# EAGLE design butter-test (EAGLE 6.5.0)
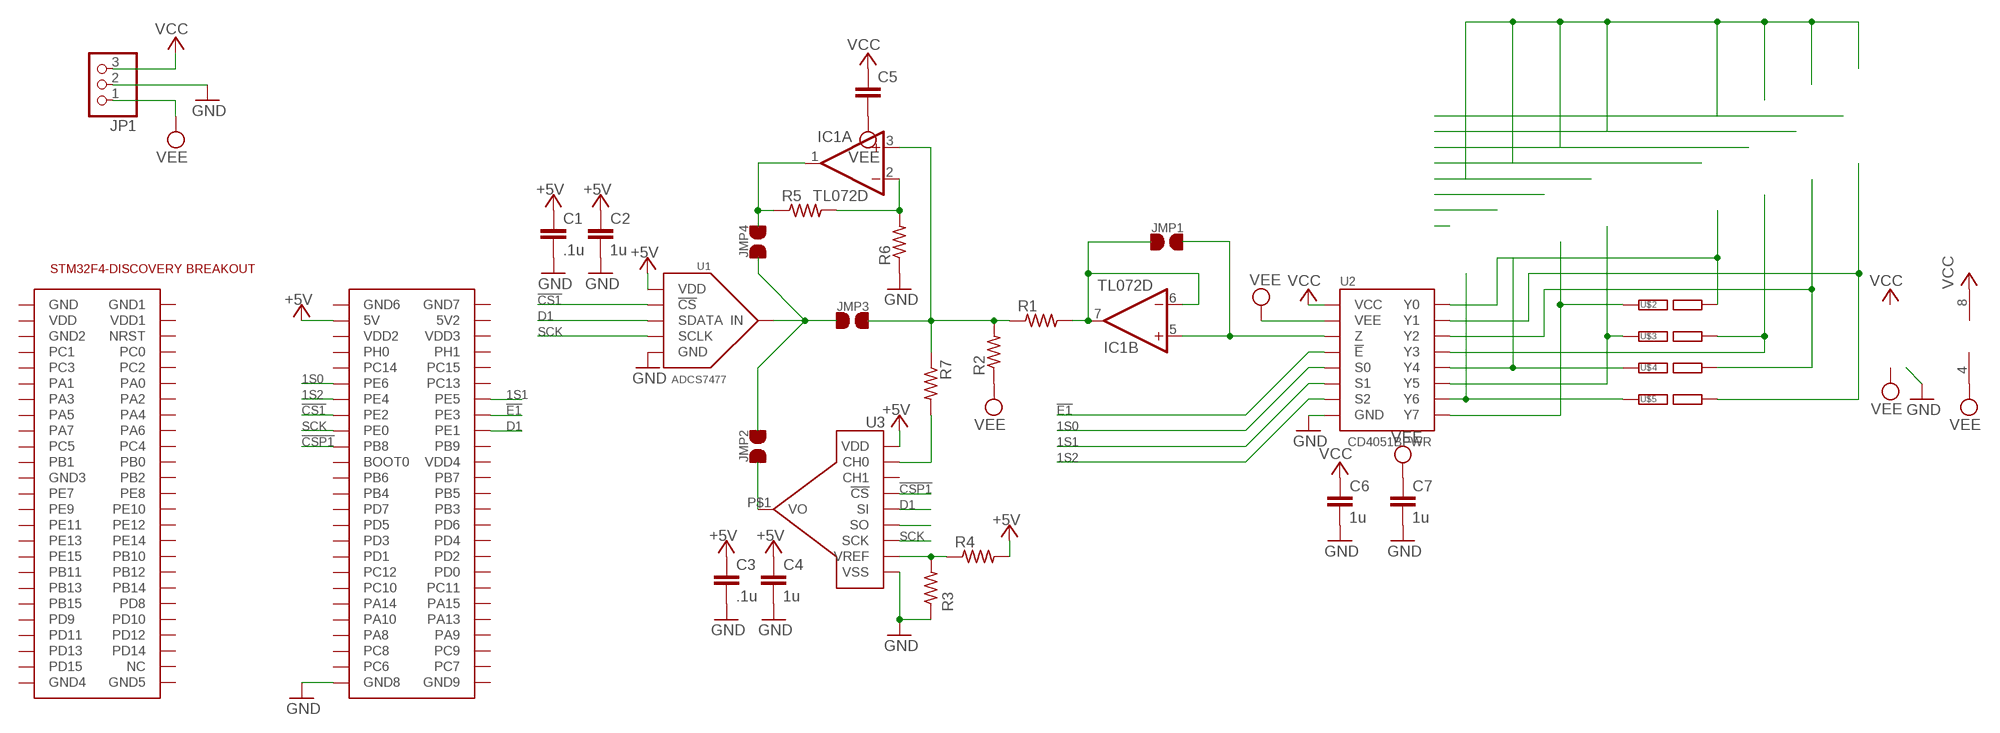
[diagram p0: schematic, sheet 1]

## Parts
C1  .1u  C-EUC0805  [C0805]
C2  1u  C-EUC0805  [C0805]
C3  .1u  C-EUC0805  [C0805]
C4  1u  C-EUC0805  [C0805]
C5  C-EUC0805  [C0805]
C6  1u  C-EUC0805  [C0805]
C7  1u  C-EUC0805  [C0805]
IC1  TL072D  [SO08]
JMP1  JMP  [JMP]
JMP2  JMP  [JMP]
JMP3  JMP  [JMP]
JMP4  JMP  [JMP]
JP1  PINHD-1X3  [1X03]
R1  R-US_R0603  [R0603]
R2  R-US_R0603  [R0603]
R3  R-US_R0603  [R0603]
R4  R-US_R0603  [R0603]
R5  R-US_R0603  [R0603]
R6  R-US_R0603  [R0603]
R7  R-US_R0603  [R0603]
U1  ADCS7477  [SOT-23-6]
U2  CD4051BPWR  [TSSOP-16]
U3  MCP6S93  [MSOP-10]
U$1  STM32F4-DISCOVERY  [STM32F4-DISCOVERY]
U$2  RAILSEP  [RAIL]
U$3  RAILSEP  [RAIL]
U$4  RAILSEP  [RAIL]
U$5  RAILSEP  [RAIL]

## Nets
1S0: U2.P$11(S0) U$1.P$61(PE6)
1S1: U2.P$10(S1) U$1.P$64(PE5)
1S2: U2.P$9(S2) U$1.P$63(PE4)
!CS1: U1.P$6(!CS) U$1.P$65(PE2)
!CSP1: U3.P$6(!CS) U$1.P$69(PB8)
!E1: U2.P$6(!E) U$1.P$66(PE3)
+5V: C1.1 C2.1 C3.1 C4.1 R4.2 U1.P$1(VDD) U3.P$10(VDD) U$1.P$53(5V)
D1: U1.P$5(SDATA) U3.P$7(SI) U$1.P$68(PE1)
GND: C1.2 C2.2 C3.2 C4.2 C6.2 C7.2 JP1.2 R3.1 R6.1 U1.P$2(GND) U2.P$8(GND) U3.P$5(VSS) U$1.P$99(GND8)
N$1: IC1.2(A:-IN) R5.2 R6.2
N$2: U2.P$13(Y0) U$2.P$R(R)
N$3: U2.P$5(Y5) U$3.P$L(L)
N$4: IC1.5(B:+IN) JMP1.P$2 U2.P$3(Z)
N$5: JMP2.P$1 U3.P$1(VO)
N$6: IC1.6(B:-IN) IC1.7(B:OUT) JMP1.P$1 R1.2
N$7: U2.P$4(Y7) U$2.P$L(L)
N$8: U2.P$12(Y3) U$3.P$R(R)
N$9: U2.P$1(Y4) U$4.P$L(L)
N$10: U2.P$15(Y2) U$4.P$R(R)
N$11: U2.P$2(Y6) U$5.P$L(L)
N$12: U2.P$14(Y1) U$5.P$R(R)
N$22: IC1.3(A:+IN) JMP3.P$2 R1.1 R2.2 R7.1
N$23: R3.2 R4.1 U3.P$4(VREF)
N$24: JMP2.P$2 JMP3.P$1 JMP4.P$1 U1.P$3(IN)
N$25: U3.P$8(SO)
N$26: IC1.1(A:OUT) JMP4.P$2 R5.1
N$27: R7.2 U3.P$2(CH0)
SCK: U1.P$4(SCLK) U3.P$9(SCK) U$1.P$67(PE0)
VCC: C5.1 C6.1 IC1.8(P:V+) JP1.3 U2.P$16(VCC)
VEE: C5.2 C7.1 IC1.4(P:V-) JP1.1 R2.1 U2.P$7(VEE)
Unconnected: U3.P$3(CH1) U$1.P$1(GND) U$1.P$2(GND1) U$1.P$3(VDD) U$1.P$4(VDD1) U$1.P$5(GND2) U$1.P$6(NRST) U$1.P$7(PC1) U$1.P$8(PC0) U$1.P$9(PC3) U$1.P$10(PC2) U$1.P$11(PA1) U$1.P$12(PA0) U$1.P$13(PA3) U$1.P$14(PA2) U$1.P$15(PA5) U$1.P$16(PA4) U$1.P$17(PA7) U$1.P$18(PA6) U$1.P$19(PC5) U$1.P$20(PC4) U$1.P$21(PB1) U$1.P$22(PB0) U$1.P$23(GND3) U$1.P$24(PB2) U$1.P$25(PE7) U$1.P$26(PE8) U$1.P$27(PE9) U$1.P$28(PE10) U$1.P$29(PE11) U$1.P$30(PE12) U$1.P$31(PE13) U$1.P$32(PE14) U$1.P$33(PE15) U$1.P$34(PB10) U$1.P$35(PB11) U$1.P$36(PB12) U$1.P$37(PB13) U$1.P$38(PB14) U$1.P$39(PB15) U$1.P$40(PD8) U$1.P$41(PD9) U$1.P$42(PD10) U$1.P$43(PD11) U$1.P$44(PD12) U$1.P$45(PD13) U$1.P$46(PD14) U$1.P$47(PD15) U$1.P$48(NC) U$1.P$49(GND4) U$1.P$50(GND5) U$1.P$51(GND6) U$1.P$52(GND7) U$1.P$54(5V2) U$1.P$55(VDD2) U$1.P$56(VDD3) U$1.P$57(PH0) U$1.P$58(PH1) U$1.P$59(PC14) U$1.P$60(PC15) U$1.P$62(PC13) U$1.P$70(PB9) U$1.P$71(BOOT0) U$1.P$72(VDD4) U$1.P$73(PB6) U$1.P$74(PB7) U$1.P$75(PB4) U$1.P$76(PB5) U$1.P$77(PD7) U$1.P$78(PB3) U$1.P$79(PD5) U$1.P$80(PD6) U$1.P$81(PD3) U$1.P$82(PD4) U$1.P$83(PD1) U$1.P$84(PD2) U$1.P$85(PC12) U$1.P$86(PD0) U$1.P$87(PC10) U$1.P$88(PC11) U$1.P$89(PA14) U$1.P$90(PA15) U$1.P$91(PA10) U$1.P$92(PA13) U$1.P$93(PA8) U$1.P$94(PA9) U$1.P$95(PC8) U$1.P$96(PC9) U$1.P$97(PC6) U$1.P$98(PC7) U$1.P$100(GND9)

## Library data of the parts
C1-C7 = rcl:C-EU: CAPACITOR, European symbol
IC1 = linear:TL072: OP AMP
JMP1-JMP4 = butter:JMP
JP1 = pinhead:PINHD-1X3: PIN HEADER
R1-R7 = resistor:R-US_: RESISTOR, American symbol
U1 = butter:ADCS7477: TI ADCS7477 10 bit 1MSPS ADC 5V 10mW Digikey <http://www.digikey.com/product-detail/en/ADCS7477AIMF%2FNOPB/ADCS7477AIMF%2FNOPBTR-ND/568478>
U2 = butter:CD4051BPWR: CD4051BPWR TI 8:1 Analog Multiplexer Digikey <http://www.digikey.com/product-detail/en/CD4051BPWR/296-11993-1-ND/390442>
U3 = butter:MCP6S93
U$1 = STM32F4-DISCOVERY:STM32F4-DISCOVERY
U$2-U$5 = butter:RAILSEP

## Board
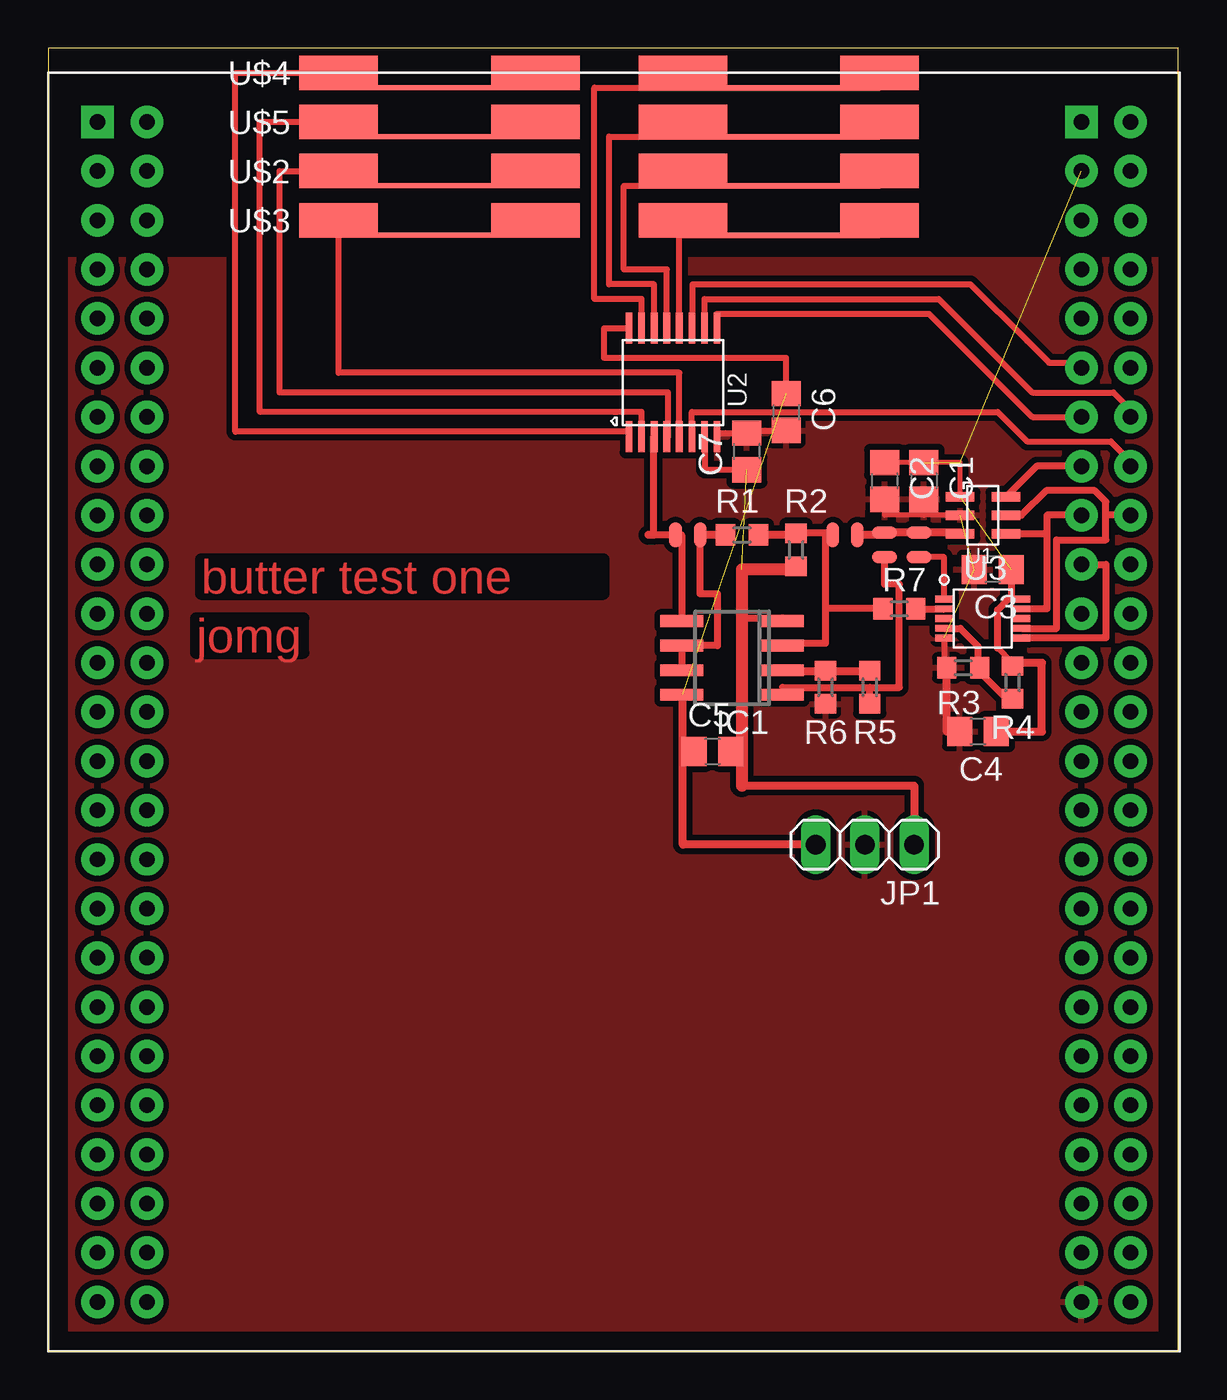
[diagram p1: board, top side]

Size 58.34 x 67.3 mm. Coordinates in mm from the lower left corner, seen from the top.
Outline: 0,0 58.34,0 58.34,67.3 0,67.3 0,0
Copper layers (1*16): Top 0.035mm / dielectric 1.5mm / Bottom 0.035mm
Design rules "default *": minimum track width 10mil, minimum drill 24mil, track to track 10mil, track to pad 10mil, pad to pad 8mil, via to via 8mil, smd to smd 8mil, copper to edge 40mil, drill to drill 8mil, minimum pad ring 10mil, minimum via ring 8mil, stop-mask expansion 4mil, vias tented up to drill 0mil, thermal gap 10mil

### Footprints (pad centres in the part's own frame; a part is rotated, then mirrored left to right if it is on the bottom)
C0805 = smd 1.3 x 1.5: 1 -0.95,0; 2 0.95,0
SO08 = smd 0.6 x 2.2: 1 -1.905,-2.6; 2 -0.635,-2.6; 3 0.635,-2.6; 4 1.905,-2.6; 5 1.905,2.6; 6 0.635,2.6; 7 -0.635,2.6; 8 -1.905,2.6
JMP = smd 0.635 x 1.27: P$1 -0.635,0; P$2 0.635,0
1X03 = drill 1.016 long: 1 -2.54,0; 2 0,0; 3 2.54,0
R0603 = smd 1 x 1.1: 1 -0.85,0; 2 0.85,0
SOT-23-6 = smd 1.473 x 0.483: P$1 -1.181,0.95; P$2 -1.181,0; P$3 -1.181,-0.95; P$4 1.181,-0.95; P$5 1.181,0; P$6 1.181,0.95
TSSOP-16 = smd 1.6 x 0.35: P$1 -2.8,2.275; P$2 -2.8,1.625; P$3 -2.8,0.975; P$4 -2.8,0.325; P$5 -2.8,-0.325; P$6 -2.8,-0.975; P$7 -2.8,-1.625; P$8 -2.8,-2.275; P$9 2.8,-2.275; P$10 2.8,-1.625; P$11 2.8,-0.975; P$12 2.8,-0.325; P$13 2.8,0.325; P$14 2.8,0.975; P$15 2.8,1.625; P$16 2.8,2.275
MSOP-10 = smd 0.9 x 0.35: P$1 -2,1; P$2 -2,0.5; P$3 -2,0; P$4 -2,-0.5; P$5 -2,-1; P$6 2,-1; P$7 2,-0.5; P$8 2,0; P$9 2,0.5; P$10 2,1
STM32F4-DISCOVERY = drill 0.8 pad 1.676 square: P$1 -27.94,30.48; P$51 22.86,30.48 | drill 0.8 pad 1.676: P$2 -25.4,30.48; P$3 -27.94,27.94; P$4 -25.4,27.94; P$5 -27.94,25.4; P$6 -25.4,25.4; P$7 -27.94,22.86; P$8 -25.4,22.86; P$9 -27.94,20.32; P$10 -25.4,20.32; P$11 -27.94,17.78; P$12 -25.4,17.78; P$13 -27.94,15.24; P$14 -25.4,15.24; P$15 -27.94,12.7; P$16 -25.4,12.7; P$17 -27.94,10.16; P$18 -25.4,10.16; P$19 -27.94,7.62; P$20 -25.4,7.62; P$21 -27.94,5.08; P$22 -25.4,5.08; P$23 -27.94,2.54; P$24 -25.4,2.54; P$25 -27.94,0; P$26 -25.4,0; P$27 -27.94,-2.54; P$28 -25.4,-2.54; P$29 -27.94,-5.08; P$30 -25.4,-5.08; P$31 -27.94,-7.62; P$32 -25.4,-7.62; P$33 -27.94,-10.16; P$34 -25.4,-10.16; P$35 -27.94,-12.7; P$36 -25.4,-12.7; P$37 -27.94,-15.24; P$38 -25.4,-15.24; P$39 -27.94,-17.78; P$40 -25.4,-17.78; P$41 -27.94,-20.32; P$42 -25.4,-20.32; P$43 -27.94,-22.86; P$44 -25.4,-22.86; P$45 -27.94,-25.4; P$46 -25.4,-25.4; P$47 -27.94,-27.94; P$48 -25.4,-27.94; P$49 -27.94,-30.48; P$50 -25.4,-30.48; P$52 25.4,30.48; P$53 22.86,27.94; P$54 25.4,27.94; P$55 22.86,25.4; P$56 25.4,25.4; P$57 22.86,22.86; P$58 25.4,22.86; P$59 22.86,20.32; P$60 25.4,20.32; P$61 22.86,17.78; P$62 25.4,17.78; P$63 22.86,15.24; P$64 25.4,15.24; P$65 22.86,12.7; P$66 25.4,12.7; P$67 22.86,10.16; P$68 25.4,10.16; P$69 22.86,7.62; P$70 25.4,7.62; P$71 22.86,5.08; P$72 25.4,5.08; P$73 22.86,2.54; P$74 25.4,2.54; P$75 22.86,0; P$76 25.4,0; P$77 22.86,-2.54; P$78 25.4,-2.54; P$79 22.86,-5.08; P$80 25.4,-5.08; P$81 22.86,-7.62; P$82 25.4,-7.62; P$83 22.86,-10.16; P$84 25.4,-10.16; P$85 22.86,-12.7; P$86 25.4,-12.7; P$87 22.86,-15.24; P$88 25.4,-15.24; P$89 22.86,-17.78; P$90 25.4,-17.78; P$91 22.86,-20.32; P$92 25.4,-20.32; P$93 22.86,-22.86; P$94 25.4,-22.86; P$95 22.86,-25.4; P$96 25.4,-25.4; P$97 22.86,-27.94; P$98 25.4,-27.94; P$99 22.86,-30.48; P$100 25.4,-30.48
RAIL = smd 14.478 x 0.254: P$1 -8.763,-0.762; P$2 8.763,-0.762 | smd 4.572 x 1.778: P$3 -3.81,0; P$4 3.81,0 | smd 4.064 x 1.778: P$L -13.97,0; P$R 13.97,0

### Placement (x,y rotation side)
C1  45.21,44.96 270 top
C2  43.18,44.96 270 top
C3  48.77,40.39 180 top
C4  48.01,32 180 top
C5  34.29,30.99 0 top
C6  38.1,48.51 270 top
C7  36.07,46.48 90 top
IC1  35.31,35.81 90 top
JMP1  33.02,42.16 180 top
JMP2  44.96,41.66 90 top
JMP3  41.15,42.16 180 top
JMP4  43.18,41.66 270 top
JP1  42.16,26.16 180 top
R1  35.81,42.16 180 top
R2  38.61,41.4 90 top
R3  47.24,35.31 0 top
R4  49.78,34.54 90 top
R5  42.42,34.29 90 top
R6  40.13,34.29 90 top
R7  43.94,38.35 0 top
U1  48.26,43.18 0 top
U2  32.26,50.04 90 top
U3  48.26,37.85 0 top
U$1  30.48,33.02 0 top
U$2  28.96,60.96 0 top
U$3  28.96,58.42 0 top
U$4  28.96,66.04 0 top
U$5  28.96,63.5 0 top

### Tracks (layer width: path | path; a pad name or v marks a point on that pad's centre or on a via)
1S0
  Top 0.305: U2.P$11 33.27,52.84 33.27,55.12 47.62,55.12 50.55,52.19 51.68,51.05 53.34,51.05 U$1.P$61
1S1
  Top 0.305: U2.P$10 33.88,54.36 45.97,54.36 49.53,50.8 50.8,49.53 55,49.53 56.13,48.39 56.13,48.26 U$1.P$64
1S2
  Top 0.305: U2.P$9 34.53,53.59 45.47,53.59 50.8,48.26 U$1.P$63
!CS1
  Top 0.356: U$1.P$65 51.03,45.72 U1.P$6
!CSP1
  Top 0.254: 54.61,36.83 54.61,36.85
  Top 0.356: U$1.P$69 54.61,40.64 54.61,36.85 U3.P$6
!E1
  Top 0.305: U2.P$6 33.23,48.51 49.02,48.51 50.55,46.99 54.86,46.99 56.13,45.72 U$1.P$66
+5V  (3 unrouted)
  Top 0.254: U1.P$1 47.08,45.91 C2.1 | 49.72,38.85 U3.P$10
  Top 0.305: 49.78,35.56 49.02,36.32 | 49.58,38.85 U3.P$10
  Top 0.356: 49.02,36.32 49.02,38.29 49.58,38.85 | C3.1 49.72,38.85
  Top 0.406: C4.1 51.31,32 51.31,35.56 49.78,35.56 R4.2
D1
  Top 0.254: 50.25,43.18 U1.P$5 | U3.P$7 50.26,37.34
  Top 0.356: U$1.P$68 54.61,43.18 | 54.61,43.18 54.61,43.88 54.04,44.45 51.52,44.45 50.25,43.18 | 50.26,37.34 52.07,37.34 52.07,41.91 54.61,41.91 54.61,43.18
GND  (2 unrouted)
  Top 0.254: 46.26,35.31 R3.1 | U1.P$2 45.21,43.18 | 45.21,43.18 43.18,43.18 C2.2 | C1.2 45.21,43.18
  Top 0.305: U3.P$5 46.26,35.31 | U2.P$8 34.53,47.43 C7.2 36.07,47.5 35.81,47.5 35.81,47.56 C6.2
  Top 0.406: C4.2 46.39,32 R3.1
  pour Top (isolate 0.305): 58.42,56.39 58.42,0 0,-0.25 0,56.39
N$1
  Top 0.406: IC1.2 37.91,35.14 R6.2 R5.2
N$2
  Top 0.305: U2.P$13 31.93,55.88 29.72,55.88 29.72,60.2 42.93,60.2 U$2.P$R
N$3
  Top 0.305: U2.P$5 32.58,50.55 14.99,50.55 U$3.P$L
N$4
  Top 0.254: 32.71,42.16 JMP1.P$2
  Top 0.305: U2.P$3 31.24,47.24
  Top 0.356: 32.71,42.16 IC1.5 | JMP1.P$2 31.24,42.16 31.24,47.24
  Top 0.406: 31.24,42.16 30.99,42.16
N$5
  Top 0.305: U3.P$1 46.26,41.02 JMP2.P$1
N$6
  Top 0.356: JMP1.P$1 33.66,39.12 34.54,39.12 34.54,36.45 IC1.6 IC1.7
  Top 0.406: R1.2 JMP1.P$1
N$7
  Top 0.305: U2.P$4 32,47.24 32,49.53 11.94,49.53 11.94,60.96 U$2.P$L
N$8
  Top 0.305: U2.P$12 32.58,57.66 42.93,57.66 U$3.P$R
N$9
  Top 0.305: U2.P$1 29.98,47.5 9.65,47.5 9.65,66.04 U$4.P$L
N$10
  Top 0.305: U2.P$15 30.63,54.36 28.19,54.36 28.19,65.28 42.93,65.28 U$4.P$R
N$11
  Top 0.305: U2.P$2 30.63,48.51 10.92,48.51 10.92,63.5 U$5.P$L
N$12
  Top 0.305: U2.P$14 31.28,55.12 28.96,55.12 28.96,62.74 42.93,62.74 U$5.P$R
N$22
  Top 0.254: IC1.3 37.91,36.58 | 40.13,42.16 JMP3.P$2
  Top 0.356: 40.51,42.25 R2.2 | 37.91,36.58 40.13,36.58 40.13,38.35 | 40.13,38.35 40.13,42.16 | R7.1 40.13,38.35
  Top 0.406: JMP3.P$2 40.51,42.25 | R2.2 38.61,42.16 R1.1
N$23
  Top 0.254: U3.P$4 46.26,37.34 | 48.01,35.31 R3.2 48.26,35.31 | R4.1 49.78,33.78
  Top 0.305: 49.78,33.78 49.4,33.78 | 48.26,34.92 48.26,35.31
  Top 0.356: 46.26,37.34 47.09,37.34 48.01,36.42 48.01,35.31 | 49.4,33.78 48.26,34.92
N$24
  Top 0.406: U1.P$3 47.08,42.29 JMP2.P$2 JMP4.P$1 43.18,42.16 JMP3.P$1
N$26
  Top 0.254: IC1.1 37.91,34.29
  Top 0.356: 37.91,34.29 42.42,34.29 | R5.1 42.42,34.29 | 42.42,34.29 43.94,34.29 43.94,39.62 43.18,39.62 JMP4.P$2
N$27
  Top 0.254: R7.2
  Top 0.356: R7.2 U3.P$2
SCK
  Top 0.356: U1.P$4 51.56,42.23 | 51.56,42.23 51.56,38.35 U3.P$9 | U$1.P$67 51.56,43.18 51.56,42.23
VCC  (1 unrouted)
  Top 0.305: U2.P$16 | C6.1 38.1,51.31 28.7,51.31 28.7,52.84 U2.P$16 | U2.P$16
  Top 0.406: JP1.3 32.77,26.16 32.77,30.99 | 32.77,30.99 32.77,33.91 IC1.8 | C5.1 32.77,30.99
VEE  (1 unrouted)
  Top 0.305: U2.P$7 33.88,45.53 C7.1
  Top 0.356: 37.91,37.85 35.81,37.85
  Top 0.406: IC1.4 37.91,37.85 | 35.81,37.85 35.81,30.99 | JP1.1 44.7,29.21 35.81,29.21 35.81,30.99 | 35.81,30.99 C5.2
  Top 0.61: R2.1 38.61,40.39 35.81,40.39 35.81,29.21

### Text on the board
Top: butter test one | jomg